# Altium project emmeteur.PrjPcb
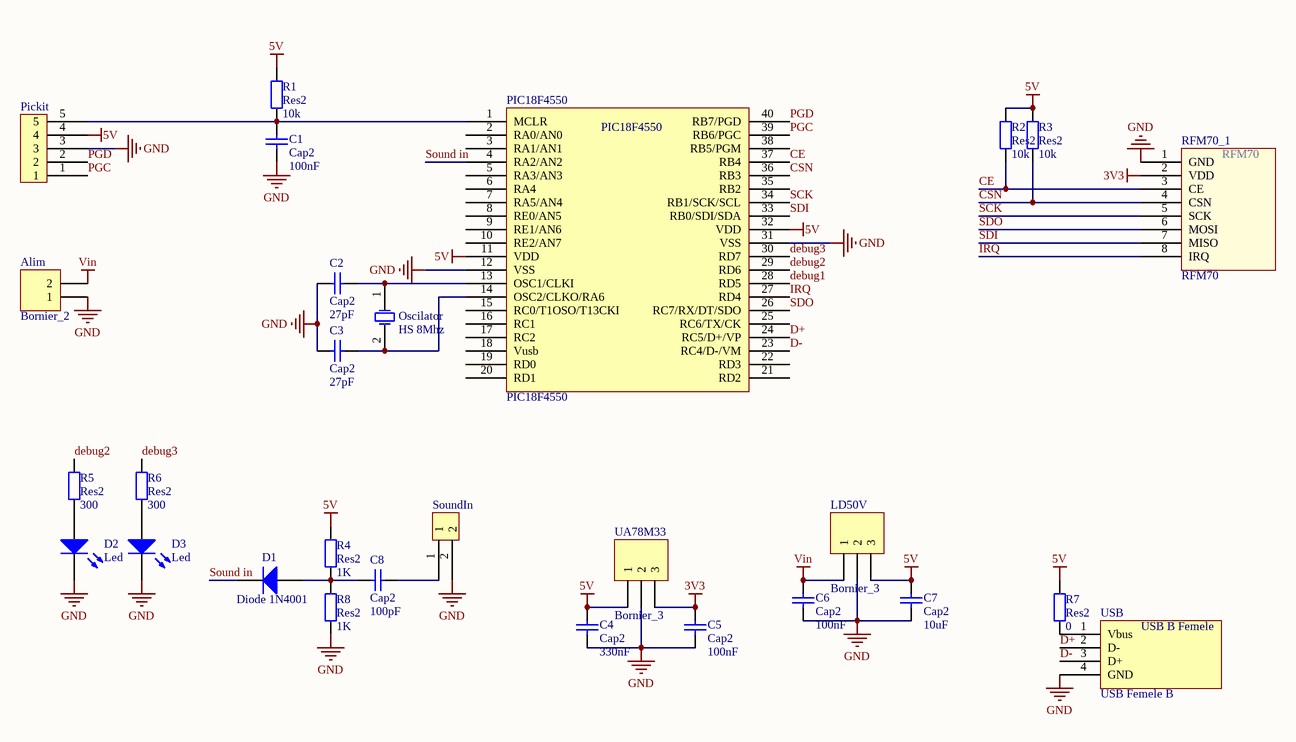
[diagram p0: emmeteur.SchDoc]
1 sheet, 28 parts. Net scope: global (net labels, ports and power ports of the same name join across sheets).
Board file: pcb_emmeteur.PcbDoc

## Sheet emmeteur.SchDoc
size A4

### Parts
Alim  Bornier_2  [Bornier_2]
C1  Cap2  value 100nF  [CAPA2]
C2  Cap2  value 27pF  [CAPA2]
C3  Cap2  value 27pF  [CAPA2]
C4  Cap2  value 330nF  [CAPA2]
C5  Cap2  value 100nF  [CAPA2]
C6  Cap2  value 100nF  [CAPA2]
C7  Cap2  value 10uF  [CAPA2]
C8  Cap2  value 100pF  [CAPA2]
D1  Diode 1N4001  [Ddiode]
D2  Led  [LED]
D3  Led  [LED]
LD50V  Bornier_3  [Bornier_3]
Oscilator  HS 8Mhz  [R38]
PIC18F4550  PIC18F4550  [pic18F4550 - duplicate]
Pickit  CONKK5  [CONKK5]  (value not drawn)
R1  Res2  value 10k  [res5_1/4W]
R2  Res2  value 10k  [res5_1/4W]
R3  Res2  value 10k  [res5_1/4W]
R4  Res2  value 1K  [res5_1/4W]
R5  Res2  value 300  [res5_1/4W]
R6  Res2  value 300  [res5_1/4W]
R7  Res2  value 0  [res5_1/4W]
R8  Res2  value 1K  [res5_1/4W]
RFM70_1  RFM70  [RFM70]
SoundIn  CONKK2  [CONKK2]  (value not drawn)
UA78M33  Bornier_3  [Bornier_3]
USB  USB Femele B  [USB-B]

### Nets
3V3: C5.2 RFM70_1.2(VDD) UA78M33.3
5V: C4.2 C7.2 LD50V.3 PIC18F4550.11(VDD) PIC18F4550.32(VDD) Pickit.4 R1.2 R2.2 R3.2 R4.2 R7.2 UA78M33.1
GND: Alim.1 C1.1 C2.1 C3.1 C4.1 C5.1 C6.1 C7.1 D2.2(K) D3.2(K) LD50V.2 PIC18F4550.12(VSS) PIC18F4550.31(VSS) Pickit.3 R8.1 RFM70_1.1(GND) SoundIn.2 UA78M33.2 USB.4(GND)
Vin: Alim.2 C6.2 LD50V.1
CE: PIC18F4550.37(RB4) R2.1 RFM70_1.3(CE)
CSN: PIC18F4550.36(RB3) R3.1 RFM70_1.4(CSN)
D+: PIC18F4550.24(RC5/D+/VP) USB.2(D-)
D-: PIC18F4550.23(RC4/D-/VM) USB.3(D+)
debug1: PIC18F4550.28(RD5)
debug2: PIC18F4550.29(RD6) R5.2
debug3: PIC18F4550.30(RD7) R6.2
IRQ: PIC18F4550.27(RD4) RFM70_1.8(IRQ)
PGC: PIC18F4550.39(RB6/PGC) Pickit.1
PGD: PIC18F4550.40(RB7/PGD) Pickit.2
SCK: PIC18F4550.34(RB1/SCK/SCL) RFM70_1.5(SCK)
SDI: PIC18F4550.33(RB0/SDI/SDA) RFM70_1.7(MISO)
SDO: PIC18F4550.26(RC7/RX/DT/SDO) RFM70_1.6(MOSI)
Sound in: D1.2(K) PIC18F4550.4(RA2/AN2)
NetC1_2: C1.2 PIC18F4550.1(MCLR) Pickit.5 R1.1
NetC2_2: C2.2 Oscilator.1(OSC1) PIC18F4550.13(OSC1/CLKI)
NetC3_2: C3.2 Oscilator.2(OSC2) PIC18F4550.14(OSC2/CLKO/RA6)
NetC8_1: C8.1 D1.1(A) R4.1 R8.2
NetC8_2: C8.2 SoundIn.1
NetD2_1: D2.1(A) R5.1
NetD3_1: D3.1(A) R6.1
NetR7_1: R7.1 USB.1(Vbus)

Not connected (* = marked no-connect by the designer): PIC18F4550 2(RA0/AN0) 3(RA1/AN1) 5(RA3/AN3) 6(RA4) 7(RA5/AN4) 8(RE0/AN5) 9(RE1/AN6) 10(RE2/AN7) 15(RC0/T1OSO/T13CKI) 16(RC1) 17(RC2) 18(Vusb) 19(RD0) 20(RD1) 21(RD2) 22(RD3) 25(RC6/TX/CK) 35(RB2) 38(RB5/PGM)

### Notes on the sheet
- (in symbol USB Femele B) USB B Femele

### Library data of the parts
Alim = Bornier_2: Header, 2-Pin; LatestRevisionDate: 17-Jul-2002; LatestRevisionNote: Re-released for DXP Platform.; Publisher: Altium Limited
C1-C8 = Cap2: Capacitor; Published: 8-Jun-2000; LatestRevisionDate: 17-Jul-2002; LatestRevisionNote: Re-released for DXP Platform.; PackageReference: RAD-0.3; Publisher: Altium Limited
D1 = Diode 1N4001: 1 Amp General Purpose Rectifier; pin to pad: 1>A 2>K; Published: 8-Jun-2000; LatestRevisionDate: 17-Jul-2002; LatestRevisionNote: Re-released for DXP Platform.; DatasheetDocument: 1998; PackageDocument: Aug-1999; PackageReference: DO-41; Publisher: Altium Limited; Code_JEDEC: DO-204-AL; ComponentLink1Description: Manufacturer Link; ComponentLink1URL: http://www.fairchildsemi.com/; ComponentLink2Description: Datasheet; ComponentLink2URL: http://www.fairchildsemi.com/ds/1N%2F1N4001.pdf
LD50V UA78M33 = Bornier_3: Header, 3-Pin; LatestRevisionDate: 17-Jul-2002; LatestRevisionNote: Re-released for DXP Platform.; Publisher: Altium Limited
Oscilator = XTAL: Crystal Oscillator; Published: 8-Jun-2000; LatestRevisionDate: 17-Jul-2002; LatestRevisionNote: Re-released for DXP Platform.; PackageReference: R38; Publisher: Altium Limited; PackageDescription: Crystal, Thru-Hole; 2 Leads; Body 3.1 x 8.2 mm (Dia.xH)
R1-R8 = Res2: Resistor; Published: 8-Jun-2000; LatestRevisionDate: 17-Jul-2002; LatestRevisionNote: Re-released for DXP Platform.; PackageReference: AXIAL-0.4; Publisher: Altium Limited
D2 D3 = Led: Published: 8-Jun-2000; LatestRevisionDate: 17-Jul-2002; LatestRevisionNote: Re-released for DXP Platform.; DatasheetDocument: 1998; PackageDocument: Aug-1999; PackageReference: DO-41; Publisher: Altium Limited; Code_JEDEC: DO-204-AL; ComponentLink1Description: Manufacturer Link; ComponentLink1URL: http://www.fairchildsemi.com/; ComponentLink2Description: Datasheet; ComponentLink2URL: http://www.fairchildsemi.com/ds/1N%2F1N4001.pdf